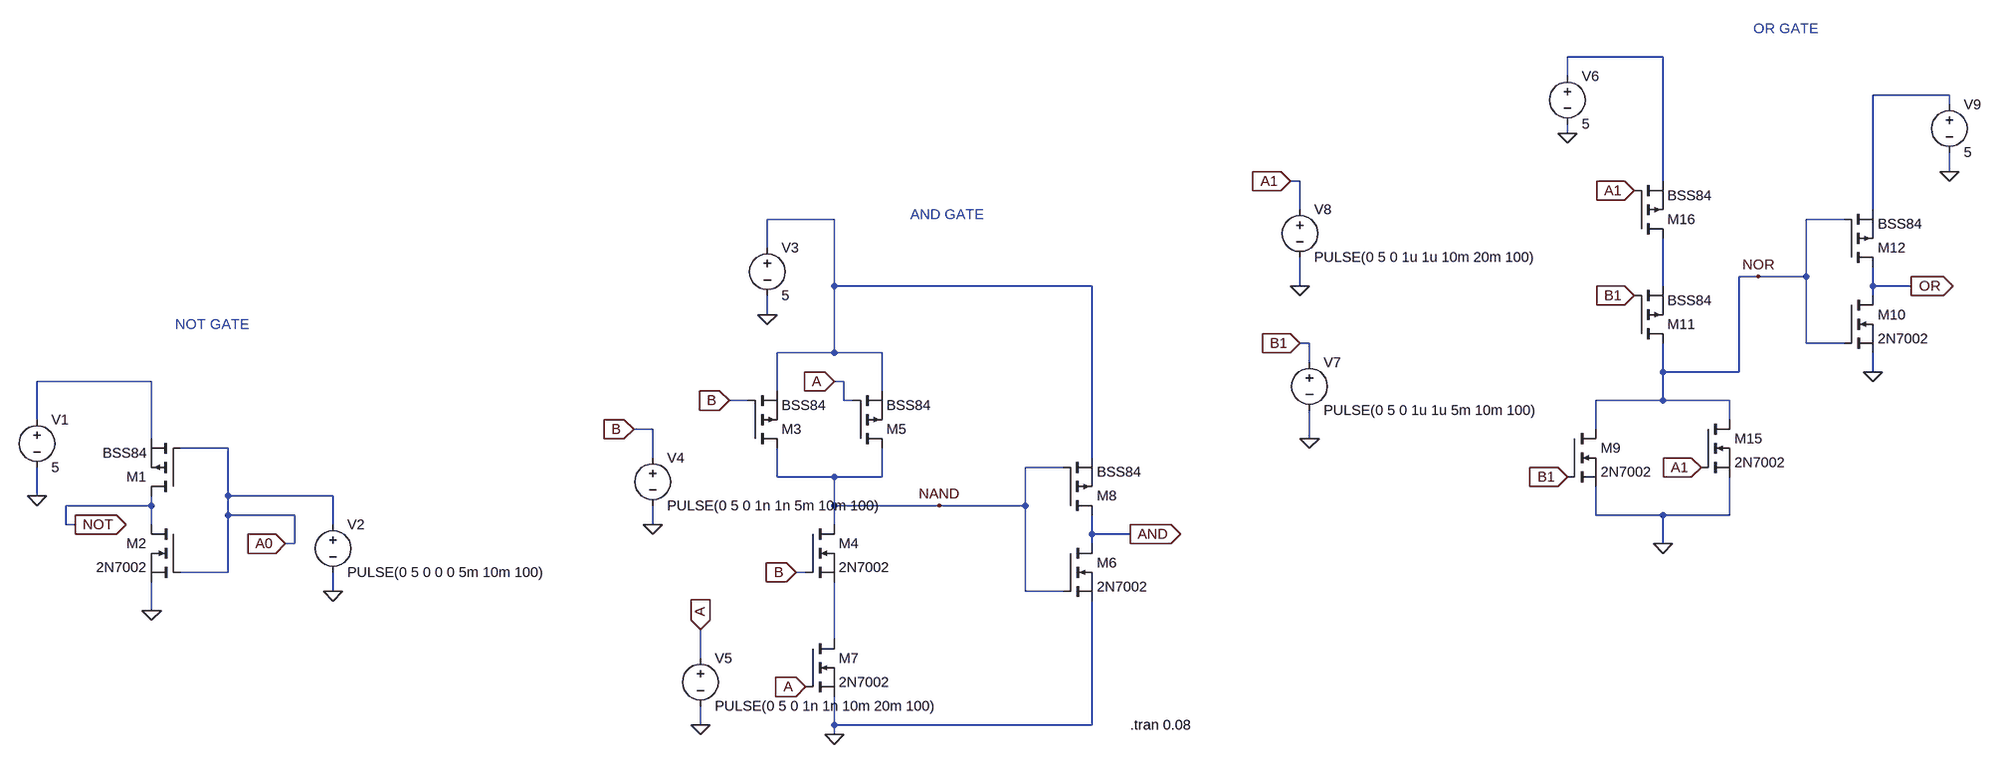
[diagram p0: schematic Discrete-CMOS-Logic-Gate-Arrays.asc]
Discrete-CMOS-Logic-Gate-Arrays.asc, the LTspice schematic file:
Version 4.1
SHEET 1 4388 724
WIRE 3504 -512 3344 -512
WIRE 3344 -480 3344 -512
WIRE 3984 -448 3856 -448
WIRE 3984 -432 3984 -448
WIRE 3344 -384 3344 -400
WIRE 3984 -320 3984 -352
WIRE 2896 -304 2880 -304
WIRE 3504 -304 3504 -512
WIRE 2896 -256 2896 -304
WIRE 3856 -256 3856 -448
WIRE 1744 -240 1632 -240
WIRE 3808 -240 3744 -240
WIRE 1632 -192 1632 -240
WIRE 3664 -144 3632 -144
WIRE 3744 -144 3744 -240
WIRE 3744 -144 3664 -144
WIRE 1744 -128 1744 -240
WIRE 2176 -128 1744 -128
WIRE 2896 -128 2896 -176
WIRE 3504 -128 3504 -208
WIRE 3856 -128 3856 -160
WIRE 3920 -128 3856 -128
WIRE 3856 -112 3856 -128
WIRE 1632 -80 1632 -112
WIRE 2912 -32 2896 -32
WIRE 3744 -32 3744 -144
WIRE 3808 -32 3744 -32
WIRE 1744 -16 1744 -128
WIRE 1744 -16 1648 -16
WIRE 1824 -16 1744 -16
WIRE 2912 0 2912 -32
WIRE 3504 16 3504 -32
WIRE 3632 16 3632 -144
WIRE 3632 16 3504 16
WIRE 3856 16 3856 -16
WIRE 192 32 0 32
WIRE 1760 32 1744 32
WIRE 1648 48 1648 -16
WIRE 1824 48 1824 -16
WIRE 1600 64 1568 64
WIRE 1760 64 1760 32
WIRE 1776 64 1760 64
WIRE 3504 64 3504 16
WIRE 3504 64 3392 64
WIRE 3616 64 3504 64
WIRE 0 96 0 32
WIRE 3616 96 3616 64
WIRE 1440 112 1408 112
WIRE 3392 112 3392 64
WIRE 192 128 192 32
WIRE 2912 128 2912 80
WIRE 320 144 240 144
WIRE 1440 160 1440 112
WIRE 2176 160 2176 -128
WIRE 2128 176 2064 176
WIRE 1648 192 1648 144
WIRE 1744 192 1648 192
WIRE 1824 192 1824 144
WIRE 1824 192 1744 192
WIRE 0 224 0 176
WIRE 320 224 320 144
WIRE 496 224 320 224
WIRE 192 240 192 224
WIRE 192 240 48 240
WIRE 1744 240 1744 192
WIRE 1920 240 1744 240
WIRE 2064 240 2064 176
WIRE 2064 240 1920 240
WIRE 320 256 320 224
WIRE 432 256 320 256
WIRE 3392 256 3392 208
WIRE 3504 256 3392 256
WIRE 3616 256 3616 192
WIRE 3616 256 3504 256
WIRE 48 272 48 240
WIRE 64 272 48 272
WIRE 192 272 192 240
WIRE 496 272 496 224
WIRE 1440 272 1440 240
WIRE 1744 272 1744 240
WIRE 2176 288 2176 256
WIRE 2240 288 2176 288
WIRE 432 304 432 256
WIRE 432 304 416 304
WIRE 2176 304 2176 288
WIRE 3504 304 3504 256
WIRE 320 352 320 256
WIRE 320 352 240 352
WIRE 1696 352 1680 352
WIRE 496 384 496 352
WIRE 2064 384 2064 240
WIRE 2128 384 2064 384
WIRE 192 416 192 368
WIRE 1744 464 1744 368
WIRE 1520 496 1520 448
WIRE 1520 608 1520 576
WIRE 1744 608 1744 560
WIRE 2176 608 2176 400
WIRE 2176 608 1744 608
WIRE 1744 624 1744 608
FLAG 192 416 0
FLAG 0 224 0
FLAG 416 304 A0
IOPIN 416 304 In
FLAG 64 272 NOT
IOPIN 64 272 Out
FLAG 496 384 0
FLAG 1520 608 0
FLAG 1744 624 0
FLAG 1632 -80 0
FLAG 2240 288 AND
IOPIN 2240 288 Out
FLAG 1408 112 B
IOPIN 1408 112 In
FLAG 1568 64 B
IOPIN 1568 64 In
FLAG 1680 352 B
IOPIN 1680 352 In
FLAG 1520 448 A
IOPIN 1520 448 In
FLAG 1696 544 A
IOPIN 1696 544 In
FLAG 1744 32 A
IOPIN 1744 32 In
FLAG 1440 272 0
FLAG 3568 176 A1
IOPIN 3568 176 In
FLAG 3344 192 B1
IOPIN 3344 192 In
FLAG 3456 -112 B1
IOPIN 3456 -112 In
FLAG 3456 -288 A1
IOPIN 3456 -288 In
FLAG 3344 -384 0
FLAG 2880 -304 A1
IOPIN 2880 -304 In
FLAG 2896 -32 B1
IOPIN 2896 -32 In
FLAG 2912 128 0
FLAG 2896 -128 0
FLAG 3504 304 0
FLAG 3920 -128 OR
IOPIN 3920 -128 Out
FLAG 3856 16 0
FLAG 3984 -320 0
FLAG 3664 -144 NOR
FLAG 1920 240 NAND
SYMBOL pmos 240 224 R180
SYMATTR InstName M1
SYMATTR Value BSS84
SYMBOL nmos 240 272 M0
SYMATTR InstName M2
SYMATTR Value 2N7002
SYMBOL voltage 0 80 R0
WINDOW 123 0 0 Left 0
WINDOW 39 0 0 Left 0
SYMATTR InstName V1
SYMATTR Value 5
SYMBOL voltage 496 256 R0
WINDOW 123 0 0 Left 0
WINDOW 39 0 0 Left 0
SYMATTR InstName V2
SYMATTR Value PULSE(0 5 0 0 0 5m 10m 100)
SYMBOL pmos 1600 144 M180
SYMATTR InstName M3
SYMATTR Value BSS84
SYMBOL nmos 1696 272 R0
SYMATTR InstName M4
SYMATTR Value 2N7002
SYMBOL pmos 1776 144 M180
SYMATTR InstName M5
SYMATTR Value BSS84
SYMBOL nmos 1696 464 R0
SYMATTR InstName M7
SYMATTR Value 2N7002
SYMBOL voltage 1632 -208 R0
WINDOW 123 0 0 Left 0
WINDOW 39 0 0 Left 0
SYMATTR InstName V3
SYMATTR Value 5
SYMBOL voltage 1440 144 R0
WINDOW 123 0 0 Left 0
WINDOW 39 0 0 Left 0
SYMATTR InstName V4
SYMATTR Value PULSE(0 5 0 1n 1n 5m 10m 100)
SYMBOL voltage 1520 480 R0
WINDOW 123 0 0 Left 0
WINDOW 39 0 0 Left 0
SYMATTR InstName V5
SYMATTR Value PULSE(0 5 0 1n 1n 10m 20m 100)
SYMBOL nmos 2128 304 R0
SYMATTR InstName M6
SYMATTR Value 2N7002
SYMBOL pmos 2128 256 M180
SYMATTR InstName M8
SYMATTR Value BSS84
SYMBOL voltage 2912 -16 R0
WINDOW 123 0 0 Left 0
WINDOW 39 0 0 Left 0
SYMATTR InstName V7
SYMATTR Value PULSE(0 5 0 1u 1u 5m 10m 100)
SYMBOL voltage 2896 -272 R0
WINDOW 123 0 0 Left 0
WINDOW 39 0 0 Left 0
SYMATTR InstName V8
SYMATTR Value PULSE(0 5 0 1u 1u 10m 20m 100)
SYMBOL nmos 3568 96 R0
SYMATTR InstName M15
SYMATTR Value 2N7002
SYMBOL nmos 3344 112 R0
SYMATTR InstName M9
SYMATTR Value 2N7002
SYMBOL pmos 3456 -208 M180
SYMATTR InstName M16
SYMATTR Value BSS84
SYMBOL pmos 3456 -32 M180
SYMATTR InstName M11
SYMATTR Value BSS84
SYMBOL voltage 3344 -496 R0
WINDOW 123 0 0 Left 0
WINDOW 39 0 0 Left 0
SYMATTR InstName V6
SYMATTR Value 5
SYMBOL nmos 3808 -112 R0
SYMATTR InstName M10
SYMATTR Value 2N7002
SYMBOL pmos 3808 -160 M180
SYMATTR InstName M12
SYMATTR Value BSS84
SYMBOL voltage 3984 -448 R0
WINDOW 123 0 0 Left 0
WINDOW 39 0 0 Left 0
SYMATTR InstName V9
SYMATTR Value 5
TEXT 2240 608 Left 2 !.tran 0.08
TEXT 232 -64 Left 2 ;NOT GATE
TEXT 1872 -248 Left 2 ;AND GATE
TEXT 3656 -560 Left 2 ;OR GATE

The netlist it stands for:
* Discrete-CMOS-Logic-Gate-Arrays.asc
M1 NOT A0 N005 N005 BSS84
M2 NOT A0 0 0 2N7002
V1 N005 0 5
V2 A0 0 PULSE(0 5 0 0 0 5m 10m 100)
M3 NAND B N003 N003 BSS84
M4 NAND B N006 N006 2N7002
M5 NAND A N003 N003 BSS84
M7 N006 A 0 0 2N7002
V3 N003 0 5
V4 B 0 PULSE(0 5 0 1n 1n 5m 10m 100)
V5 A 0 PULSE(0 5 0 1n 1n 10m 20m 100)
M6 AND NAND 0 0 2N7002
M8 AND NAND N003 N003 BSS84
V7 B1 0 PULSE(0 5 0 1u 1u 5m 10m 100)
V8 A1 0 PULSE(0 5 0 1u 1u 10m 20m 100)
M15 NOR A1 0 0 2N7002
M9 NOR B1 0 0 2N7002
M16 N004 A1 N001 N001 BSS84
M11 NOR B1 N004 N004 BSS84
V6 N001 0 5
M10 OR NOR 0 0 2N7002
M12 OR NOR N002 N002 BSS84
V9 N002 0 5
.model NMOS NMOS
.model PMOS PMOS
.lib standard.mos
.tran 0.08
* NOT GATE
* AND GATE
* OR GATE
.backanno
.end